# Altium project RFSoC-AMC.PrjPCB (part 10 of 22)

## Sheet Supply_CORE.SchDoc: RFSoC AMC
size 420 x 297 mm; CompanyName: WUT; DrawnBy: T. Przywozki; Organization: WUT ISE; Address1: Warsaw University of Technology; Address2: Nowowiejska 15/19 00-665 Warsaw; Address3: Tomasz.Przywozki@pw.edu.pl; DocumentNumber: 23; Revision: 1; SheetNumber: 23; SheetTotal: 45; Project: RFSoC AMC; ModifiedBy: T. Przywozki; CreateDate: -; CheckedDate: -; DivGrp: ISE; Designer: T. Przywozki; ModifiedDate: -; ProjectName: ADC/DAC MEZZANINE
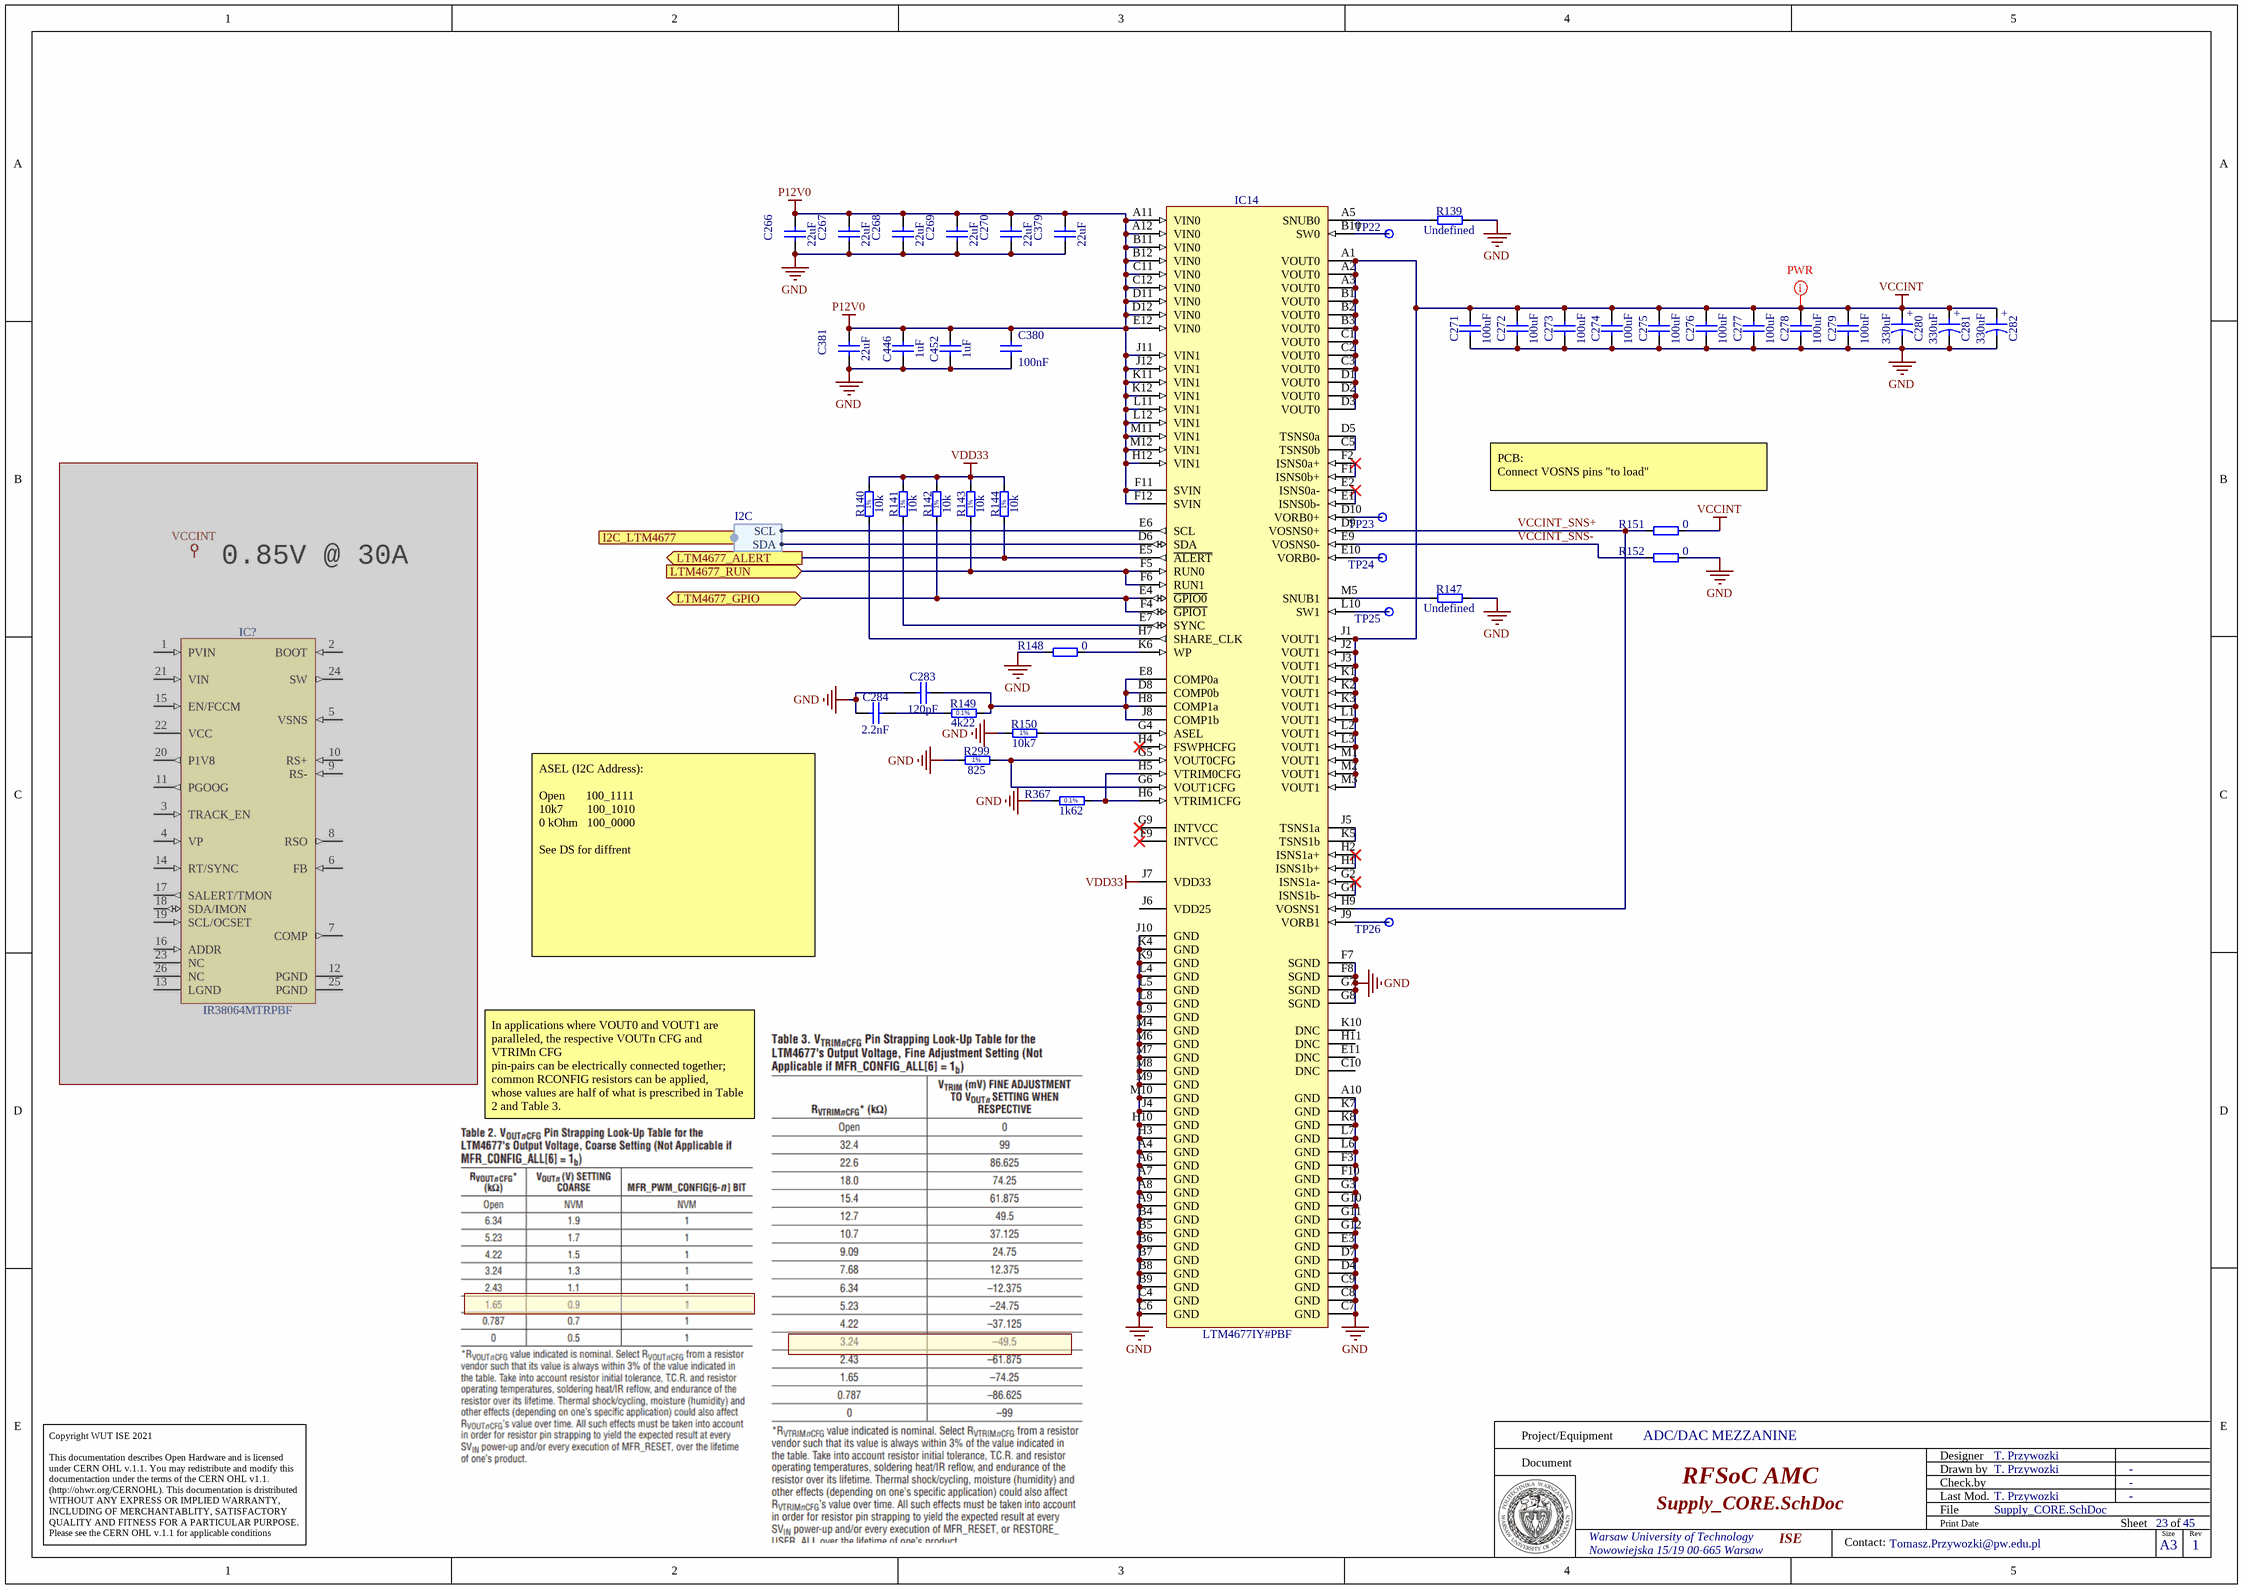
[diagram p21: Supply_CORE.SchDoc]

### Parts
C266  22uF  [CAPC2012X135N]
C267  22uF  [CAPC2012X135N]
C268  22uF  [CAPC2012X135N]
C269  22uF  [CAPC2012X135N]
C270  22uF  [CAPC2012X135N]
C271  100uF  [CAPC3225X270N]
C272  100uF  [CAPC3225X270N]
C273  100uF  [CAPC3225X270N]
C274  100uF  [CAPC3225X270N]
C275  100uF  [CAPC3225X270N]
C276  100uF  [CAPC3225X270N]
C277  100uF  [CAPC3225X270N]
C278  100uF  [CAPC3225X270N]
C279  100uF  [CAPC3225X270N]
C280  330uF  [CAPMP3528X210N]
C281  330uF  [CAPMP3528X210N]
C282  330uF  [CAPMP3528X210N]
C283  120pF  [CAPC1005X55N]
C284  2.2nF  [CAPC0603X33N]
C379  22uF  [CAPC2012X135N]
C380  100nF  [CAPC1005X55N]
C381  22uF  [CAPC2012X135N]
C446  1uF  [CAPC1608X87N]
C452  1uF  [CAPC1608X87N]
IC14  LTM4677IY#PBF  [BGA144C127P12X12_1600X1600X521]
IC?  IR38064MTRPBF  [INFINEON_PG-IQFN-34-900]  (masked out: inside a compile mask, not in the netlist)
R139  Undefined  [RESC1005X40N]
R140  10k  [RESC1005X40N]
R141  10k  [RESC1005X40N]
R142  10k  [RESC1005X40N]
R143  10k  [RESC1005X40N]
R144  10k  [RESC1005X40N]
R147  Undefined  [RESC1005X40N]
R148  0  [RESC1005X40N]
R149  4k22  [RESC1608X55N]
R150  10k7  [RESC1608X55N]
R151  0  [RESC1005X40N]
R152  0  [RESC1005X40N]
R299  825  [RESC1005X40N]
R367  1k62  [RESC1608X55N]
TP22  Test Point  [TPS127]  (value not drawn)
TP23  Test Point  [TPS127]  (value not drawn)
TP24  Test Point  [TPS127]  (value not drawn)
TP25  Test Point  [TPS127]  (value not drawn)
TP26  Test Point  [TPS127]  (value not drawn)

### Ports
I2C_LTM4677 (harness I2C), LTM4677_ALERT (out), LTM4677_GPIO (bidir), LTM4677_RUN (in)

### Harnesses
I2C: SCL, SDA

### Nets
GND: C266.1 C267.1 C268.1 C269.1 C270.1 C271.1 C272.1 C273.1 C274.1 C275.1 C276.1 C277.1 C278.1 C279.1 C280.2 C281.2 C282.2 C283.1 C284.1 C379.1 C380.1 C381.1 C446.1 C452.1 IC14.A4(GND) IC14.A6(GND) IC14.A7(GND) IC14.A8(GND) IC14.A9(GND) IC14.A10(GND) IC14.B4(GND) IC14.B5(GND) IC14.B6(GND) IC14.B7(GND) IC14.B8(GND) IC14.B9(GND) IC14.C4(GND) IC14.C6(GND) IC14.C7(GND) IC14.C8(GND) IC14.C9(GND) IC14.D4(GND) IC14.D7(GND) IC14.E3(GND) IC14.F3(GND) IC14.F7(SGND) IC14.F8(SGND) IC14.F10(GND) IC14.G3(GND) IC14.G7(SGND) IC14.G8(SGND) IC14.G10(GND) IC14.G11(GND) IC14.G12(GND) IC14.H3(GND) IC14.H10(GND) IC14.J4(GND) IC14.J10(GND) IC14.K4(GND) IC14.K7(GND) IC14.K8(GND) IC14.K9(GND) IC14.L4(GND) IC14.L5(GND) IC14.L6(GND) IC14.L7(GND) IC14.L8(GND) IC14.L9(GND) IC14.M4(GND) IC14.M6(GND) IC14.M7(GND) IC14.M8(GND) IC14.M9(GND) IC14.M10(GND) R139.2 R147.2 R148.1 R150.1 R152.2 R299.1 R367.1
P12V0: C266.2 C267.2 C268.2 C269.2 C270.2 C379.2 C380.2 C381.2 C446.2 C452.2 IC14.A11(VIN0) IC14.A12(VIN0) IC14.B11(VIN0) IC14.B12(VIN0) IC14.C11(VIN0) IC14.C12(VIN0) IC14.D11(VIN0) IC14.D12(VIN0) IC14.E12(VIN0) IC14.F11(SVIN) IC14.F12(SVIN) IC14.H12(VIN1) IC14.J11(VIN1) IC14.J12(VIN1) IC14.K11(VIN1) IC14.K12(VIN1) IC14.L11(VIN1) IC14.L12(VIN1) IC14.M11(VIN1) IC14.M12(VIN1)
VCCINT: C271.2 C272.2 C273.2 C274.2 C275.2 C276.2 C277.2 C278.2 C279.2 C280.1 C281.1 C282.1 IC14.A1(VOUT0) IC14.A2(VOUT0) IC14.A3(VOUT0) IC14.B1(VOUT0) IC14.B2(VOUT0) IC14.B3(VOUT0) IC14.C1(VOUT0) IC14.C2(VOUT0) IC14.C3(VOUT0) IC14.D1(VOUT0) IC14.D2(VOUT0) IC14.D3(VOUT0) IC14.J1(VOUT1) IC14.J2(VOUT1) IC14.J3(VOUT1) IC14.K1(VOUT1) IC14.K2(VOUT1) IC14.K3(VOUT1) IC14.L1(VOUT1) IC14.L2(VOUT1) IC14.L3(VOUT1) IC14.M1(VOUT1) IC14.M2(VOUT1) IC14.M3(VOUT1) R151.2
VDD33: IC14.J7(VDD33) R140.2 R141.2 R142.2 R143.2 R144.2
LTM4677_ALERT: IC14.E5(~{ALERT}) R144.1 ; port LTM4677_ALERT
SCL4: IC14.E6(SCL) ; port I2C_LTM4677.SCL
SDA4: IC14.D6(SDA) ; port I2C_LTM4677.SDA
VCCINT_SNS+: IC14.D9(VOSNS0+) IC14.H9(VOSNS1) R151.1
VCCINT_SNS-: IC14.E9(VOSNS0-) R152.1
NetC283_2: C283.2 IC14.D8(COMP0b) IC14.E8(COMP0a) IC14.H8(COMP1a) IC14.J8(COMP1b) R149.2
NetC284_2: C284.2 R149.1
NetIC14_A5: IC14.A5(SNUB0) R139.1
NetIC14_B10: IC14.B10(SW0) TP22.1
NetIC14_C5: IC14.C5(TSNS0b) IC14.D5(TSNS0a)
NetIC14_D10: IC14.D10(VORB0+) TP23.1
NetIC14_E1: IC14.E1(ISNS0b-) IC14.E2(ISNS0a-)
NetIC14_E4: IC14.E4(~{GPIO0}) IC14.F4(~{GPIO1}) R142.1 ; port LTM4677_GPIO
NetIC14_E7: IC14.E7(SYNC) R141.1
NetIC14_E10: IC14.E10(VORB0-) TP24.1
NetIC14_F1: IC14.F1(ISNS0b+) IC14.F2(ISNS0a+)
NetIC14_F5: IC14.F5(RUN0) IC14.F6(RUN1) R143.1 ; port LTM4677_RUN
NetIC14_G1: IC14.G1(ISNS1b-) IC14.G2(ISNS1a-)
NetIC14_G4: IC14.G4(ASEL) R150.2
NetIC14_G5: IC14.G5(VOUT0CFG) IC14.G6(VOUT1CFG) R299.2
NetIC14_H1: IC14.H1(ISNS1b+) IC14.H2(ISNS1a+)
NetIC14_H5: IC14.H5(VTRIM0CFG) IC14.H6(VTRIM1CFG) R367.2
NetIC14_H7: IC14.H7(SHARE_CLK) R140.1
NetIC14_J5: IC14.J5(TSNS1a) IC14.K5(TSNS1b)
NetIC14_J9: IC14.J9(VORB1) TP26.1
NetIC14_K6: IC14.K6(WP) R148.2
NetIC14_L10: IC14.L10(SW1) TP25.1
NetIC14_M5: IC14.M5(SNUB1) R147.1

Not connected (* = marked no-connect by the designer): IC14 C10(DNC) E11(DNC) F9(INTVCC)* G9(INTVCC)* H4(FSWPHCFG)* H11(DNC) J6(VDD25) K10(DNC)

### Layout directives
net class PWR: VCCINT

### Notes on the sheet
- (near R151) PCB:
  Connect VOSNS pins "to load"
- 0.85V @ 30A
- ASEL (I2C Address):
  Open       100_1111
  10k7        100_1010
  0 kOhm   100_0000
  See DS for diffrent
- In applications where VOUT0 and VOUT1 are paralleled, the respective VOUTn CFG and VTRIMn CFG
  pin-pairs can be electrically connected together; common RCONFIG resistors can be applied,
  whose values are half of what is prescribed in Table 2 and Table 3.
- Project/Equipment
- Document
- Designer
- Drawn by
- Check.by
- Copyright WUT ISE 2021
  This documentation describes Open Hardware and is licensed under CERN OHL v.1.1. You may redistribute and modify this documentaction under the terms of the CERN OHL v1.1.
  (http://ohwr.org/CERNOHL). This documentation is dristributed WITHOUT ANY EXPRESS OR IMPLIED WARRANTY, INCLUDING OF MERCHANTABLITY, SATISFACTORY QUALITY AND FITNESS FOR A PARTICULAR PURPOSE. Please see the CERN OHL v.1.1 for applicable conditions
- File
- Last Mod.
- Print Date
- Sheet
- Size
- A3
- of
- Rev
- Contact:
- (in symbol CTE3528-21_330UF_2.5V_20%_LESR0015_KEMET_T520) +
- (in symbol R0402_10K_1%_0.0625W_100PPM) 1%
- (in symbol R0402_825R_1%_0.0625W_100PPM) 1%
- (in symbol R0603_1K62_0.1%_0.063W_10PPM) 0.1%
- (in symbol R0603_4K22_0.1%_0.063W_10PPM) 0.1%
- (in symbol R0603_10K7_1%_0.1W_100PPM) 1%

### Library data of the parts
C266-C270 C379 C381 = CC0805_22UF_16V_10%_X5R: as C482 on sheet Power_Management_RFMC_RTM; Manufacturer Part Number: CC0805_22UF_16V_10%_X5R; Part Number: CC0805_22UF_16V_10%_X5R; Value: 22uF; Component Kind: Standard; Component Type: Standard; Pin Count: 2; Status: Preferred; Case: 0805; Mounted: Yes; Socket: No; SMD: Yes; Sense: No; Manufacturer1 Example: TDK; Manufacturer1 ComponentHeight: 1.35mm; HelpURL: \\cern.ch\dfs\Applications\Altium\Datasheets\CC0805_X5R_TDK_C.pdf; Author: CERN DEM JLC; CreateDate: 25.10.2012; LatestRevisionDate: 25.10.2012
C271-C279 = CC1210_100UF_6.3V_20%_X5R: Non-polarised capacitor; Part Description: SMD Multilayer Chip Ceramic Capacitor; Manufacturer: GENERIC; Manufacturer1 Part Number: GRM32ER60J107ME20L; Voltage: 6.3V; TC: X5R; Tolerance: ±20%; Part Number: CC1210_100UF_6.3V_20%_X5R; Component Kind: Standard; Component Type: Standard; Pin Count: 2; Value: 100uF; Status: Preferred; Manufacturer Part Number: CC1210_100UF_6.3V_20%_X5R; Case: 1210; Mounted: Yes; Socket: No; SMD: Yes; Sense: No; Manufacturer1 Example: MURATA; Manufacturer1 ComponentHeight: 2.7mm; HelpURL: \\cern.ch\dfs\Applications\Altium\Datasheets\CC1210_X5R_MURATA.pdf; Author: CERN DEM JLC; CreateDate: 19.04.2010; LatestRevisionDate: 19.04.2010
C280-C282 = CTE3528-21_330UF_2.5V_20%_LESR0015_KEMET_T520: Polarised capacitor; Part Description: Low ESR 0R015 Tantalum Chip Capacitor; Manufacturer: KEMET; Manufacturer Part Number: T520B337M2R5ATE015; Voltage: 2.5V; Tolerance: ±20%; Part Number: CTE3528-21_330UF_2.5V_20%_LESR0015_KEMET_T520; Component Kind: Standard; Component Type: Standard; Pin Count: 2; Value: 330uF; Status: None; Case: B; Mounted: Yes; Socket: No; SMD: Yes; Sense: No; ComponentHeight: 2.1mm; HelpURL: \\cern.ch\dfs\Applications\Altium\Datasheets\CTE-LESR_KEMET_T520.pdf; Author: CERN DEM JLC; CreateDate: 07.03.2012; LatestRevisionDate: 01.09.2014
C283 = CC0402_120PF_50V_5%_C0G: Non-polarised capacitor; Part Description: SMD Multilayer Chip Ceramic Capacitor; Manufacturer: GENERIC; Manufacturer1 Part Number: C0402C121J5GACTU; Voltage: 50V; TC: C0G/NP0; Tolerance: ±5%; Part Number: CC0402_120PF_50V_5%_C0G; Component Kind: Standard; Component Type: Standard; Pin Count: 2; Value: 120pF; Status: Preferred; Manufacturer Part Number: CC0402_120PF_50V_5%_C0G; Case: 0402; Mounted: Yes; Socket: No; SMD: Yes; Sense: No; Manufacturer1 Example: KEMET; Manufacturer1 ComponentHeight: 0.55mm; HelpURL: \\cern.ch\dfs\Applications\Altium\Datasheets\CC0805_C0G_KEMET_(Commercial Grade).pdf; Author: CERN DEM JLC; CreateDate: 10.11.2011; LatestRevisionDate: 22.04.2015
C284 = CC0201_2.2NF_16V_10%_X5R: Non-polarised capacitor; Part Description: SMD Multilayer Chip Ceramic Capacitor; Manufacturer: GENERIC; Manufacturer1 Part Number: 0201YD222KAT2A; Voltage: 16V; TC: X5R; Tolerance: ±10%; Part Number: CC0201_2.2NF_16V_10%_X5R; Component Kind: Standard; Component Type: Standard; Pin Count: 2; Value: 2.2nF; Status: Not Recommended; Manufacturer Part Number: CC0201_2.2NF_16V_10%_X5R; Case: 0201; Mounted: Yes; Socket: No; SMD: Yes; Sense: No; Manufacturer1 Example: AVX; Manufacturer1 ComponentHeight: 0.33mm; HelpURL: \\cern.ch\dfs\Applications\Altium\Datasheets\CC0201_X5R_AVX.pdf; Author: CERN DEM JLC; CreateDate: 03.12.2007; LatestRevisionDate: 03.12.2007
C380 = CC0402_100NF_16V_10%_X5R: as C469 on sheet Power_Management_RFMC_RTM; Manufacturer Part Number: CC0402_100NF_16V_10%_X5R; Part Number: CC0402_100NF_16V_10%_X5R; Value: 100nF; Component Kind: Standard; Component Type: Standard; Pin Count: 2; Status: None; Case: 0402; Mounted: Yes; Socket: No; SMD: Yes; Sense: No; Manufacturer1 Example: MURATA; Manufacturer1 ComponentHeight: 0.55mm; HelpURL: \\cern.ch\dfs\Applications\Altium\Datasheets\CC0402_X5R_MURATA_GRM.pdf; Author: CERN DEM JLC; CreateDate: 10/12/2013; LatestRevisionDate: 10/12/2013
C446 C452 = CC0603_1UF_25V_10%_X7R: Non-polarised capacitor; Manufacturer: GENERIC; Part Description: SMD Multilayer Chip Ceramic Capacitor; Manufacturer1 Part Number: GRM188R71E105KA12D; Tolerance: ±10%; Voltage: 25V; TC: X7R; Manufacturer Part Number: CC0603_1UF_25V_10%_X7R; Part Number: CC0603_1UF_25V_10%_X7R; Value: 1uF; Component Kind: Standard; Component Type: Standard; Pin Count: 2; Status: None; Case: 0603; Mounted: Yes; Socket: No; SMD: Yes; Sense: No; Manufacturer1 Example: MURATA; Manufacturer1 ComponentHeight: 0.9mm; HelpURL: \\cern.ch\dfs\Applications\Altium\Datasheets\CC0603_X7R_MURATA.pdf; Author: CERN DEM JLC; CreateDate: 18.01.2011; LatestRevisionDate: 18.01.2011
IC14 = LTM4677IY#PBF: 4.5V-16V to 0.5V-1.8V, Dual 18A or Single 36A uModule Regulator with Digital Power System Management; Manufacturer: LINEAR TECHNOLOGY; PressFit: No; Bonding: No; Part Number: LTM4677IY#PBF; Component Kind: Standard; Component Type: Standard; Device: LTM4677IY#PBF; PackageDescription: BGA, 1.27mm Pitch, Square; 144 Pin, 12 Columns X 12 Rows,16.00mm X 16.00mm X 5.21mm H; Part Description: 4.5V-16V to 0.5V-1.8V, Dual 18A or Single 36A uModule Regulator with Digital Power System Management; Manufacturer Part Number: LTM4677IY#PBF; Pin Count: 144; Case: BGA144; Mounted: Yes; Socket: No; SMD: Yes; Sense: No; ComponentHeight: 5.21mm; HelpURL: \\cern.ch\dfs\Applications\Altium\Datasheets\LTM4677IY#PBF.pdf; Author: CERN DEM JLC; CreateDate: 25/04/2018; LatestRevisionDate: 25/04/2018
IC? = IR38064MTRPBF: 35A Single-input Voltage, Synchronous Buck Regulator with PMBus Interface; Manufacturer: INFINEON; PressFit: No; Bonding: No; Status Comment: Solder Paste Deposition Limitation; Part Number: IR38064MTRPBF; Component Kind: Standard; Component Type: Standard; Device: IR38064MTRPBF; PackageDescription: INFINEON PG-IQFN-34-900 Package, QFN 26 Pin, 0.50mm Pitch, Rectangular; 5mm X 7mm X 1mm H Body (w/thermal tab); Status: Not Recommended; Part Description: 35A Single-input Voltage, Synchronous Buck Regulator with PMBus Interface; Manufacturer Part Number: IR38064MTRPBF; Pin Count: 26; Case: QFN; Mounted: Yes; Socket: No; SMD: Yes; Sense: No; ComponentHeight: 1mm; HelpURL: \\cern.ch\dfs\Applications\Altium\Datasheets\IR38064MTRPBF.pdf; Author: CERN DEM JLC; CreateDate: 28.08.2018; LatestRevisionDate: 28.08.2018
R139 R147 = R0402_NO-VALUE: Resistor; Part Description: Reserved Footprint For a 0402 (1005) Chip Resistor; PressFit: No; Mounted: No; Part Number: R0402_NO-VALUE; Component Kind: Standard; Component Type: Standard; Pin Count: 2; Value: Undefined; Status: None; Manufacturer: Undefined; Manufacturer Part Number: R0402_NO-VALUE; Case: 0402; Sense: No; Socket: No; SMD: Yes; Manufacturer1 Example: Undefined; Manufacturer1 Part Number: Undefined; Manufacturer1 ComponentHeight: Undefined; HelpURL: Undefined; Author: CERN DEM JLC; CreateDate: 03.12.2007; LatestRevisionDate: 13.03.2008
R140-R144 = R0402_10K_1%_0.0625W_100PPM: as R516#1 on sheet Thermometers; Part Number: R0402_10K_1%_0.0625W_100PPM; Component Kind: Standard; Component Type: Standard; Pin Count: 2; Value: 10k; Status: Not Recommended; Power: 0.0625W; Tolerance: ±1%; Manufacturer Part Number: R0402_10K_1%_0.0625W_100PPM; Case: 0402; Mounted: Yes; Sense: No; Socket: No; SMD: Yes; Manufacturer1 Example: YAGEO PHYCOMP; Manufacturer1 ComponentHeight: 0.4mm; HelpURL: \\cern.ch\dfs\Applications\Altium\Datasheets\R0402_Phycomp_RC0402.pdf; Author: CERN DEM JLC; CreateDate: 03.12.2007; LatestRevisionDate: 17.10.2012
R148 R151 R152 = R0402_0R_JUMPER: Resistor; Part Description: 1A (0.05R Max DC Resistance) Zero Ohm Jumper; Manufacturer: GENERIC; Manufacturer1 Part Number: 232270591001L; PressFit: No; Part Number: R0402_0R_JUMPER; Component Kind: Standard; Component Type: Standard; Pin Count: 2; Value: 0; Status: Not Recommended; Manufacturer Part Number: R0402_0R_JUMPER; Case: 0402; Mounted: Yes; Sense: No; Socket: No; SMD: Yes; Manufacturer1 Example: YAGEO PHYCOMP; Manufacturer1 ComponentHeight: 0.4mm; HelpURL: \\cern.ch\dfs\Applications\Altium\Datasheets\R0402_Phycomp_RC0402.pdf; Author: CERN DEM JLC; CreateDate: 03.12.2007; LatestRevisionDate: 17.10.2012
R149 = R0603_4K22_0.1%_0.063W_10PPM: Resistor - 0.1%; Part Description: Thin Film Chip Resistor; Manufacturer: GENERIC; Manufacturer1 Part Number: RN73C1J4K22BTDF; Power: 0.063W; TC: ±10ppm; PressFit: No; Part Number: R0603_4K22_0.1%_0.063W_10PPM; Component Kind: Standard; Component Type: Standard; Pin Count: 2; Value: 4k22; Status: Not Recommended; Tolerance: ±0.1%; Manufacturer Part Number: R0603_4K22_0.1%_0.063W_10PPM; Case: 0603; Mounted: Yes; Sense: No; Socket: No; SMD: Yes; Manufacturer1 Example: TYCO HOLSWORTHY; Manufacturer1 ComponentHeight: 0.5mm; HelpURL: \\cern.ch\dfs\Applications\Altium\Datasheets\R0603_Tyco_RN73.pdf; Author: CERN DEM JLC; CreateDate: 03.12.2007; LatestRevisionDate: 13.03.2008
R150 = R0603_10K7_1%_0.1W_100PPM: Resistor - 1%; Part Description: General Purpose Thick Film Chip Resistor; Manufacturer: GENERIC; Manufacturer1 Part Number: CRCW060310K7FKEA; Power: 0.1W; TC: ±100ppm/°C; PressFit: No; Part Number: R0603_10K7_1%_0.1W_100PPM; Component Kind: Standard; Component Type: Standard; Pin Count: 2; Value: 10k7; Status: Preferred; Tolerance: ±1%; Manufacturer Part Number: R0603_10K7_1%_0.1W_100PPM; Case: 0603; Mounted: Yes; Sense: No; Socket: No; SMD: Yes; Manufacturer1 Example: VISHAY; Manufacturer1 ComponentHeight: 0.55mm; HelpURL: \\cern.ch\dfs\Applications\Altium\Datasheets\R0603_VISHAY_CRCW e3.pdf; Author: CERN DEM JLC; CreateDate: 14.03.2018; LatestRevisionDate: 14.03.2018
R299 = R0402_825R_1%_0.0625W_100PPM: Resistor - 1%; Part Description: General Purpose Thick Film Chip Resistor; Manufacturer: GENERIC; Manufacturer1 Part Number: CRCW0402825RFKED; TC: ±100ppm/°C; PressFit: No; Part Number: R0402_825R_1%_0.0625W_100PPM; Component Kind: Standard; Component Type: Standard; Pin Count: 2; Value: 825; Status: None; Power: 0.0625W; Tolerance: ±1%; Manufacturer Part Number: R0402_825R_1%_0.0625W_100PPM; Case: 0402; Mounted: Yes; Sense: No; Socket: No; SMD: Yes; Manufacturer1 Example: VISHAY; Manufacturer1 ComponentHeight: 0.4mm; HelpURL: \\cern.ch\dfs\Applications\Altium\Datasheets\R0402_VISHAY_CRCW e3.pdf; Author: CERN DEM MR; CreateDate: 22.11.2016; LatestRevisionDate: 22.11.2016
R367 = R0603_1K62_0.1%_0.063W_10PPM: Resistor - 0.1%; Part Description: Thin Film Chip Resistor; Manufacturer: GENERIC; Manufacturer1 Part Number: RN73C1J1K62BTDF; Power: 0.063W; TC: ±10ppm; PressFit: No; Part Number: R0603_1K62_0.1%_0.063W_10PPM; Component Kind: Standard; Component Type: Standard; Pin Count: 2; Value: 1k62; Status: Not Recommended; Tolerance: ±0.1%; Manufacturer Part Number: R0603_1K62_0.1%_0.063W_10PPM; Case: 0603; Mounted: Yes; Sense: No; Socket: No; SMD: Yes; Manufacturer1 Example: TYCO HOLSWORTHY; Manufacturer1 ComponentHeight: 0.5mm; HelpURL: \\cern.ch\dfs\Applications\Altium\Datasheets\R0603_Tyco_RN73.pdf; Author: CERN DEM JLC; CreateDate: 03.12.2007; LatestRevisionDate: 13.03.2008
TP22-TP26 = SMD_PAD_1.27X1.27MM: as TP20 on sheet ADC_DAC_Supply; Part Number: SMD_PAD_1.27X1.27MM; Component Kind: Standard (No BOM); Component Type: Standard (No BOM); Pin Count: 1; Family: Test Point; Socket: No; SMD: Yes; Sense: No; Status: None; ComponentHeight: 0mm; HelpURL: Undefined; Author: CERN DEM JLC; CreateDate: 12.01.2008; LatestRevisionDate: 12.01.2008; PackageDescription: 1.27mm x 1.27mm PCB Copper Area (SMD Test Point)

## Sheet Supply_LDOs.SchDoc: RFSoC AMC
size 420 x 297 mm; CompanyName: WUT; DrawnBy: T. Przywozki; Organization: WUT ISE; Address1: Warsaw University of Technology; Address2: Nowowiejska 15/19 00-665 Warsaw; Address3: Tomasz.Przywozki@pw.edu.pl; DocumentNumber: 22; Revision: 1; SheetNumber: 22; SheetTotal: 45; Project: RFSoC AMC; ModifiedBy: T. Przywozki; CreateDate: -; CheckedDate: -; DivGrp: ISE; Designer: T. Przywozki; ModifiedDate: -; ProjectName: ADC/DAC MEZZANINE
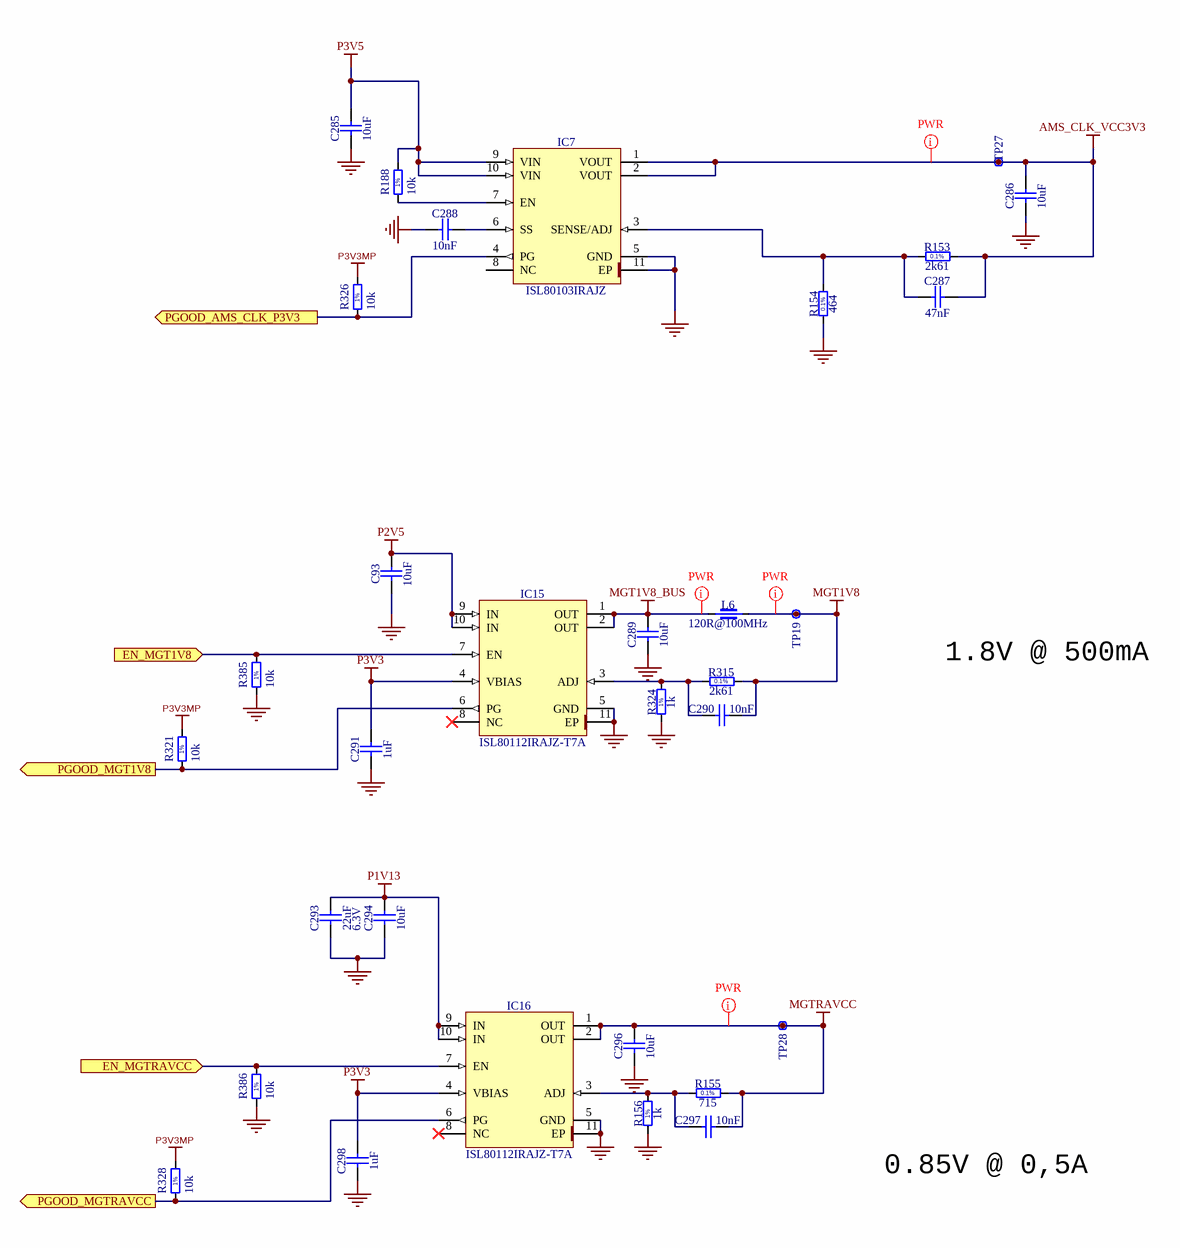
[diagram p22: Supply_LDOs.SchDoc]

### Parts
C93  10uF  [CAPC1608X80N]
C285  10uF  [CAPC1608X80N]
C286  10uF  [CAPC1608X80N]
C287  47nF  [CAPC1005X55N]
C288  10nF  [CAPC1005X55N]
C289  10uF  [CAPC1608X80N]
C290  10nF  [CAPC1005X55N]
C291  1uF  [CAPC1005X55N]
C293  22uF  Voltage: 6.3V  [CAPC1709X100N]
C294  10uF  [CAPC1608X80N]
C296  10uF  [CAPC1608X80N]
C297  10nF  [CAPC1005X55N]
C298  1uF  [CAPC1005X55N]
IC7  ISL80103IRAJZ  [RENESAS_L10.3X3]
IC15  ISL80112IRAJZ-T7A  [RENESAS_L10.3X3]
IC16  ISL80112IRAJZ-T7A  [RENESAS_L10.3X3]
L6  120R@100MHz  [INDC1608X95N]
R153  2k61  [RESC1608X55N]
R154  464  [RESC1608X55N]
R155  715  [RESC1608X55N]
R156  1k  [RESC1608X55N]
R188  10k  [RESC1005X40N]
R315  2k61  [RESC1608X55N]
R321  10k  [RESC1005X40N]
R324  1k  [RESC1608X55N]
R326  10k  [RESC1005X40N]
R328  10k  [RESC1005X40N]
R385  10k  [RESC1005X40N]
R386  10k  [RESC1005X40N]
TP19  Test Point  [TPS127]  (value not drawn)
TP27  Test Point  [TPS127]  (value not drawn)
TP28  Test Point  [TPS127]  (value not drawn)

### Ports
EN_MGT1V8 (in), EN_MGTRAVCC (in), PGOOD_AMS_CLK_P3V3 (out), PGOOD_MGT1V8 (out), PGOOD_MGTRAVCC (out)

### Nets
AMS_CLK_VCC3V3: C286.2 C287.2 IC7.1(VOUT) IC7.2(VOUT) R153.2 TP27.1
GND: C93.1 C285.1 C286.1 C288.1 C289.1 C291.1 C293.1 C294.1 C296.1 C298.1 IC7.5(GND) IC7.11(EP) IC15.5(GND) IC15.11(EP) IC16.5(GND) IC16.11(EP) R154.1 R156.1 R324.1 R385.1 R386.1
MGT1V8: C290.2 L6.2 R315.2 TP19.1
MGT1V8_BUS: C289.2 IC15.1(OUT) IC15.2(OUT) L6.1
MGTRAVCC: C296.2 C297.2 IC16.1(OUT) IC16.2(OUT) R155.2 TP28.1
P1V13: C293.2 C294.2 IC16.9(IN) IC16.10(IN)
P2V5: C93.2 IC15.9(IN) IC15.10(IN)
P3V3: C291.2 C298.2 IC15.4(VBIAS) IC16.4(VBIAS)
P3V3MP: R321.2 R326.2 R328.2
P3V5: C285.2 IC7.9(VIN) IC7.10(VIN) R188.2
EN_MGT1V8: IC15.7(EN) R385.2 ; port EN_MGT1V8
EN_MGTRAVCC: IC16.7(EN) R386.2 ; port EN_MGTRAVCC
PGOOD_AMS_CLK_P3V3: IC7.4(PG) R326.1 ; port PGOOD_AMS_CLK_P3V3
PGOOD_MGT1V8: IC15.6(PG) R321.1 ; port PGOOD_MGT1V8
PGOOD_MGTRAVCC: IC16.6(PG) R328.1 ; port PGOOD_MGTRAVCC
NetC287_1: C287.1 IC7.3(SENSE/ADJ) R153.1 R154.2
NetC288_2: C288.2 IC7.6(SS)
NetC290_1: C290.1 IC15.3(ADJ) R315.1 R324.2
NetC297_1: C297.1 IC16.3(ADJ) R155.1 R156.2
NetIC7_7: IC7.7(EN) R188.1

Not connected (* = marked no-connect by the designer): IC7 8(NC); IC15 8(NC)*; IC16 8(NC)*

### Layout directives
net class PWR: AMS_CLK_VCC3V3, MGT1V8, MGT1V8_BUS, MGTRAVCC

### Notes on the sheet
- 1.8V @ 500mA
- 0.85V @ 0,5A
- Project/Equipment
- Document
- Designer
- Drawn by
- Check.by
- Copyright WUT ISE 2021
  This documentation describes Open Hardware and is licensed under CERN OHL v.1.1. You may redistribute and modify this documentaction under the terms of the CERN OHL v1.1.
  (http://ohwr.org/CERNOHL). This documentation is dristributed WITHOUT ANY EXPRESS OR IMPLIED WARRANTY, INCLUDING OF MERCHANTABLITY, SATISFACTORY QUALITY AND FITNESS FOR A PARTICULAR PURPOSE. Please see the CERN OHL v.1.1 for applicable conditions
- File
- Last Mod.
- Print Date
- Sheet
- Size
- A3
- of
- Rev
- Contact:
- (in symbol R0402_10K_1%_0.0625W_100PPM) 1%
- (in symbol R0603_1K_1%_0.1W_100PPM) 1%
- (in symbol R0603_2K61_0.1%_0.063W_10PPM) 0.1%
- (in symbol R0603_464R_0.1%_0.063W_10PPM) 0.1%
- (in symbol R0603_715R_0.1%_0.063W_10PPM) 0.1%

### Library data of the parts
C93 C285 C286 C289 C294 C296 = CC0603_10UF_10V_10%_X5R: as C300 on sheet ADC_DAC_Supply; Part Number: CC0603_10UF_10V_10%_X5R; Component Kind: Standard; Component Type: Standard; Pin Count: 2; Value: 10uF; Status: None; Manufacturer Part Number: CC0603_10UF_10V_10%_X5R; Case: 0603; Mounted: Yes; Socket: No; SMD: Yes; Sense: No; Manufacturer1 Example: MURATA; Manufacturer1 ComponentHeight: 0.8mm; HelpURL: \\cern.ch\dfs\Applications\Altium\Datasheets\CC0603_MURATA_GRM188R61A106KE69D.pdf; Author: CERN DEM JLC; CreateDate: 31.01.2017; LatestRevisionDate: 31.01.2017
C287 = CC0402_47NF_16V_10%_X7R: Non-polarised capacitor; Part Description: SMD Multilayer Chip Ceramic Capacitor; Manufacturer: GENERIC; Manufacturer1 Part Number: 223878715645; Voltage: 16V; TC: X7R; Tolerance: ±10%; Part Number: CC0402_47NF_16V_10%_X7R; Component Kind: Standard; Component Type: Standard; Pin Count: 2; Value: 47nF; Status: Not Recommended; Manufacturer Part Number: CC0402_47NF_16V_10%_X7R; Case: 0402; Mounted: Yes; Socket: No; SMD: Yes; Sense: No; Manufacturer1 Example: PHYCOMP; Manufacturer1 ComponentHeight: 0.55mm; HelpURL: \\cern.ch\dfs\Applications\Altium\Datasheets\CC0402_X7R_PHYCOMP.pdf; Author: CERN DEM JLC; CreateDate: 03.12.2007; LatestRevisionDate: 03.12.2007
C288 = CC0402_10NF_16V_10%_X7R: Non-polarised capacitor; Part Description: SMD Multilayer Chip Ceramic Capacitor; Manufacturer: GENERIC; Manufacturer1 Part Number: 223878715636; Voltage: 16V; TC: X7R; Tolerance: ±10%; Part Number: CC0402_10NF_16V_10%_X7R; Component Kind: Standard; Component Type: Standard; Pin Count: 2; Value: 10nF; Status: Not Recommended; Manufacturer Part Number: CC0402_10NF_16V_10%_X7R; Case: 0402; Mounted: Yes; Socket: No; SMD: Yes; Sense: No; Manufacturer1 Example: PHYCOMP; Manufacturer1 ComponentHeight: 0.55mm; HelpURL: \\cern.ch\dfs\Applications\Altium\Datasheets\CC0402_X7R_PHYCOMP.pdf; Author: CERN DEM JLC; CreateDate: 03.12.2007; LatestRevisionDate: 03.12.2007
C290 C297 = CC0402_10NF_25V_10%_X7R: as C302 on sheet ADC_DAC_Supply; Part Number: CC0402_10NF_25V_10%_X7R; Component Kind: Standard; Component Type: Standard; Pin Count: 2; Value: 10nF; Status: Preferred; Manufacturer Part Number: CC0402_10NF_25V_10%_X7R; Case: 0402; Mounted: Yes; Socket: No; SMD: Yes; Sense: No; Manufacturer1 Example: TDK; Manufacturer1 ComponentHeight: 0.55mm; HelpURL: \\cern.ch\dfs\Applications\Altium\Datasheets\CC0402_X7R_TDK_C.pdf; Author: CERN DEM JLC; CreateDate: 25.10.2012; LatestRevisionDate: 25.10.2012
C291 C298 = CC0402_1UF_16V_10%_X5R: as C303 on sheet ADC_DAC_Supply; Part Number: CC0402_1UF_16V_10%_X5R; Component Kind: Standard; Component Type: Standard; Pin Count: 2; Value: 1uF; Status: Preferred; Manufacturer Part Number: CC0402_1UF_16V_10%_X5R; Case: 0402; Mounted: Yes; Socket: No; SMD: Yes; Sense: No; Manufacturer1 Example: TDK; Manufacturer1 ComponentHeight: 0.55mm; HelpURL: \\cern.ch\dfs\Applications\Altium\Datasheets\CC0402_X5R_TDK_C.pdf; Author: CERN DEM JLC; CreateDate: 25.10.2012; LatestRevisionDate: 25.10.2012
C293 = CC0603_22UF_6.3V_20%_X5R: as C299 on sheet ADC_DAC_Supply; Part Number: CC0603_22UF_6.3V_20%_X5R; Component Kind: Standard; Component Type: Standard; Pin Count: 2; Value: 22uF; Status: None; Manufacturer Part Number: CC0603_22UF_6.3V_20%_X5R; Case: 0603; Mounted: Yes; Socket: No; SMD: Yes; Sense: No; Manufacturer1 Example: TDK; Manufacturer1 ComponentHeight: 1mm; HelpURL: \\cern.ch\dfs\Applications\Altium\Datasheets\CC0603_X5R_TDK_C.pdf; Author: CERN DEM JLC; CreateDate: 16.12.2013; LatestRevisionDate: 13.09.2016
IC7 = ISL80103IRAJZ: High Performance 3A Linear Regulators; Manufacturer: RENESAS ELECTRONICS; PressFit: No; Bonding: No; Part Number: ISL80103IRAJZ; Component Kind: Standard; Component Type: Standard; Device: ISL80103IRAJZ; PackageDescription: SON(DFN), 0.50mm Pitch, Square; 10 Pin, 3.00mm L X 3.00mm W X 1.00mm H body (w/Thermal Tab 1.60 x2.00mm); Part Description: High Performance 3A Linear Regulators; Manufacturer Part Number: ISL80103IRAJZ; Pin Count: 11; Case: SON10; Mounted: Yes; Socket: No; SMD: Yes; Sense: No; ComponentHeight: 1mm; HelpURL: \\cern.ch\dfs\Applications\Altium\Datasheets\ISL80103IRAJZ.pdf; Author: CERN DEM MR; CreateDate: 23.04.2019; LatestRevisionDate: 23.04.2019
IC15 IC16 = ISL80112IRAJZ-T7A: as IC17 on sheet ADC_DAC_Supply; Part Number: ISL80112IRAJZ-T7A; Component Kind: Standard; Component Type: Standard; Device: ISL80112IRAJZ-T7A; PackageDescription: SON(DFN), 0.50mm Pitch, Square; 10 Pin, 3.00mm L X 3.00mm W X 1.00mm H body (w/Thermal Tab 1.60 x2.00mm); Manufacturer Part Number: ISL80112IRAJZ-T7A; Pin Count: 11; Case: SON10; Mounted: Yes; Socket: No; SMD: Yes; Sense: No; ComponentHeight: 1mm; HelpURL: \\cern.ch\dfs\Applications\Altium\Datasheets\ISL80112IRAJZ-T7A.pdf; Author: CERN DEM JLC; CreateDate: 04.12.2018; LatestRevisionDate: 04.12.2018
L6 = IND0603_MURATA_BLM18PG121SN1D: as L5 on sheet Power_Management_RFMC_RTM; Case: 0603; ComponentHeight: 0.95mm; Manufacturer Part Number: BLM18PG121SN1D; Part Number: IND0603_MURATA_BLM18PG121SN1D; Pin Count: 2; SMD: Yes; Value: 120R@100MHz; Component Kind: Standard; Component Type: Standard; Status: None; Mounted: Yes; Socket: No; Sense: No; HelpURL: \\cern.ch\dfs\Applications\Altium\Datasheets\IND0603_MURATA_BLM18P.pdf; Author: CERN DEM BC; CreateDate: 27.07.2015; LatestRevisionDate: 25.10.2018
R153 R315 = R0603_2K61_0.1%_0.063W_10PPM: as R334 on sheet ADC_DAC_Supply; Part Number: R0603_2K61_0.1%_0.063W_10PPM; Component Kind: Standard; Component Type: Standard; Pin Count: 2; Value: 2k61; Status: Not Recommended; Tolerance: ±0.1%; Manufacturer Part Number: R0603_2K61_0.1%_0.063W_10PPM; Case: 0603; Mounted: Yes; Sense: No; Socket: No; SMD: Yes; Manufacturer1 Example: TYCO HOLSWORTHY; Manufacturer1 ComponentHeight: 0.5mm; HelpURL: \\cern.ch\dfs\Applications\Altium\Datasheets\R0603_Tyco_RN73.pdf; Author: CERN DEM JLC; CreateDate: 03.12.2007; LatestRevisionDate: 13.03.2008
R154 = R0603_464R_0.1%_0.063W_10PPM: Resistor - 0.1%; Part Description: Thin Film Chip Resistor; Manufacturer: GENERIC; Manufacturer1 Part Number: RN73C1J464RBTDF; Power: 0.063W; TC: ±10ppm; PressFit: No; Part Number: R0603_464R_0.1%_0.063W_10PPM; Component Kind: Standard; Component Type: Standard; Pin Count: 2; Value: 464; Status: Not Recommended; Tolerance: ±0.1%; Manufacturer Part Number: R0603_464R_0.1%_0.063W_10PPM; Case: 0603; Mounted: Yes; Sense: No; Socket: No; SMD: Yes; Manufacturer1 Example: TYCO HOLSWORTHY; Manufacturer1 ComponentHeight: 0.5mm; HelpURL: \\cern.ch\dfs\Applications\Altium\Datasheets\R0603_Tyco_RN73.pdf; Author: CERN DEM JLC; CreateDate: 03.12.2007; LatestRevisionDate: 13.03.2008
R155 = R0603_715R_0.1%_0.063W_10PPM: Resistor - 0.1%; Part Description: Thin Film Chip Resistor; Manufacturer: GENERIC; Manufacturer1 Part Number: RN73C1J715RBTDF; Power: 0.063W; TC: ±10ppm; PressFit: No; Part Number: R0603_715R_0.1%_0.063W_10PPM; Component Kind: Standard; Component Type: Standard; Pin Count: 2; Value: 715; Status: Not Recommended; Tolerance: ±0.1%; Manufacturer Part Number: R0603_715R_0.1%_0.063W_10PPM; Case: 0603; Mounted: Yes; Sense: No; Socket: No; SMD: Yes; Manufacturer1 Example: TYCO HOLSWORTHY; Manufacturer1 ComponentHeight: 0.5mm; HelpURL: \\cern.ch\dfs\Applications\Altium\Datasheets\R0603_Tyco_RN73.pdf; Author: CERN DEM JLC; CreateDate: 03.12.2007; LatestRevisionDate: 13.03.2008
R156 R324 = R0603_1K_1%_0.1W_100PPM: as R384 on sheet ADC_DAC_Supply; Part Number: R0603_1K_1%_0.1W_100PPM; Component Kind: Standard; Component Type: Standard; Pin Count: 2; Value: 1k; Status: Preferred; Tolerance: ±1%; Manufacturer Part Number: R0603_1K_1%_0.1W_100PPM; Case: 0603; Mounted: Yes; Sense: No; Socket: No; SMD: Yes; Manufacturer1 Example: NIC COMPONENT; Manufacturer1 ComponentHeight: 0.55mm; HelpURL: \\cern.ch\dfs\Applications\Altium\Datasheets\R0603_NIC_NRC.pdf; Author: CERN DEM JLC; CreateDate: 03.12.2007; LatestRevisionDate: 13.03.2008
R188 R321 R326 R328 R385 R386 = R0402_10K_1%_0.0625W_100PPM: as R619-R623 on sheet USB_SERIAL_QUAD; Manufacturer Part Number: R0402_10K_1%_0.0625W_100PPM; Part Number: R0402_10K_1%_0.0625W_100PPM; Tolerance: ±1%; Value: 10k; Component Kind: Standard; Component Type: Standard; Pin Count: 2; Status: Not Recommended; Power: 0.0625W; Case: 0402; Mounted: Yes; Sense: No; Socket: No; SMD: Yes; Manufacturer1 Example: YAGEO PHYCOMP; Manufacturer1 ComponentHeight: 0.4mm; HelpURL: \\cern.ch\dfs\Applications\Altium\Datasheets\R0402_Phycomp_RC0402.pdf; Author: CERN DEM JLC; CreateDate: 03/12/2007; LatestRevisionDate: 17/10/2012
TP19 TP27 TP28 = SMD_PAD_1.27X1.27MM: as TP20 on sheet ADC_DAC_Supply; Part Number: SMD_PAD_1.27X1.27MM; Component Kind: Standard (No BOM); Component Type: Standard (No BOM); Pin Count: 1; Family: Test Point; Socket: No; SMD: Yes; Sense: No; Status: None; ComponentHeight: 0mm; HelpURL: Undefined; Author: CERN DEM JLC; CreateDate: 12.01.2008; LatestRevisionDate: 12.01.2008; PackageDescription: 1.27mm x 1.27mm PCB Copper Area (SMD Test Point)